# Altium schematic sheet HardwareArchitecture.SchDoc: Iris
size A3; Organization: Toradex AG; Address1: Altsagenstrasse 5; Address2: Horw; Address3: 6048; Address4: Switzerland; DocumentNumber: 2; Revision: V2.0; SheetNumber: 2; SheetTotal: 16; PageSetup: Record=PageOptions|CenterHorizontal=True|CenterVertical=True|PrintScale=0.73|XCorrection=1.00|YCorrection=1.00|PrintKind=0|BorderSize=5000000|LeftOffset=0|BottomOffset=0|Orientation=2|PaperLength=1000|PaperWidth=1000|Scale=100|PaperSource=7|PrintQuality=600|MediaType=1|DitherType=10|PaperKind=A4|PrintScaleMode=1
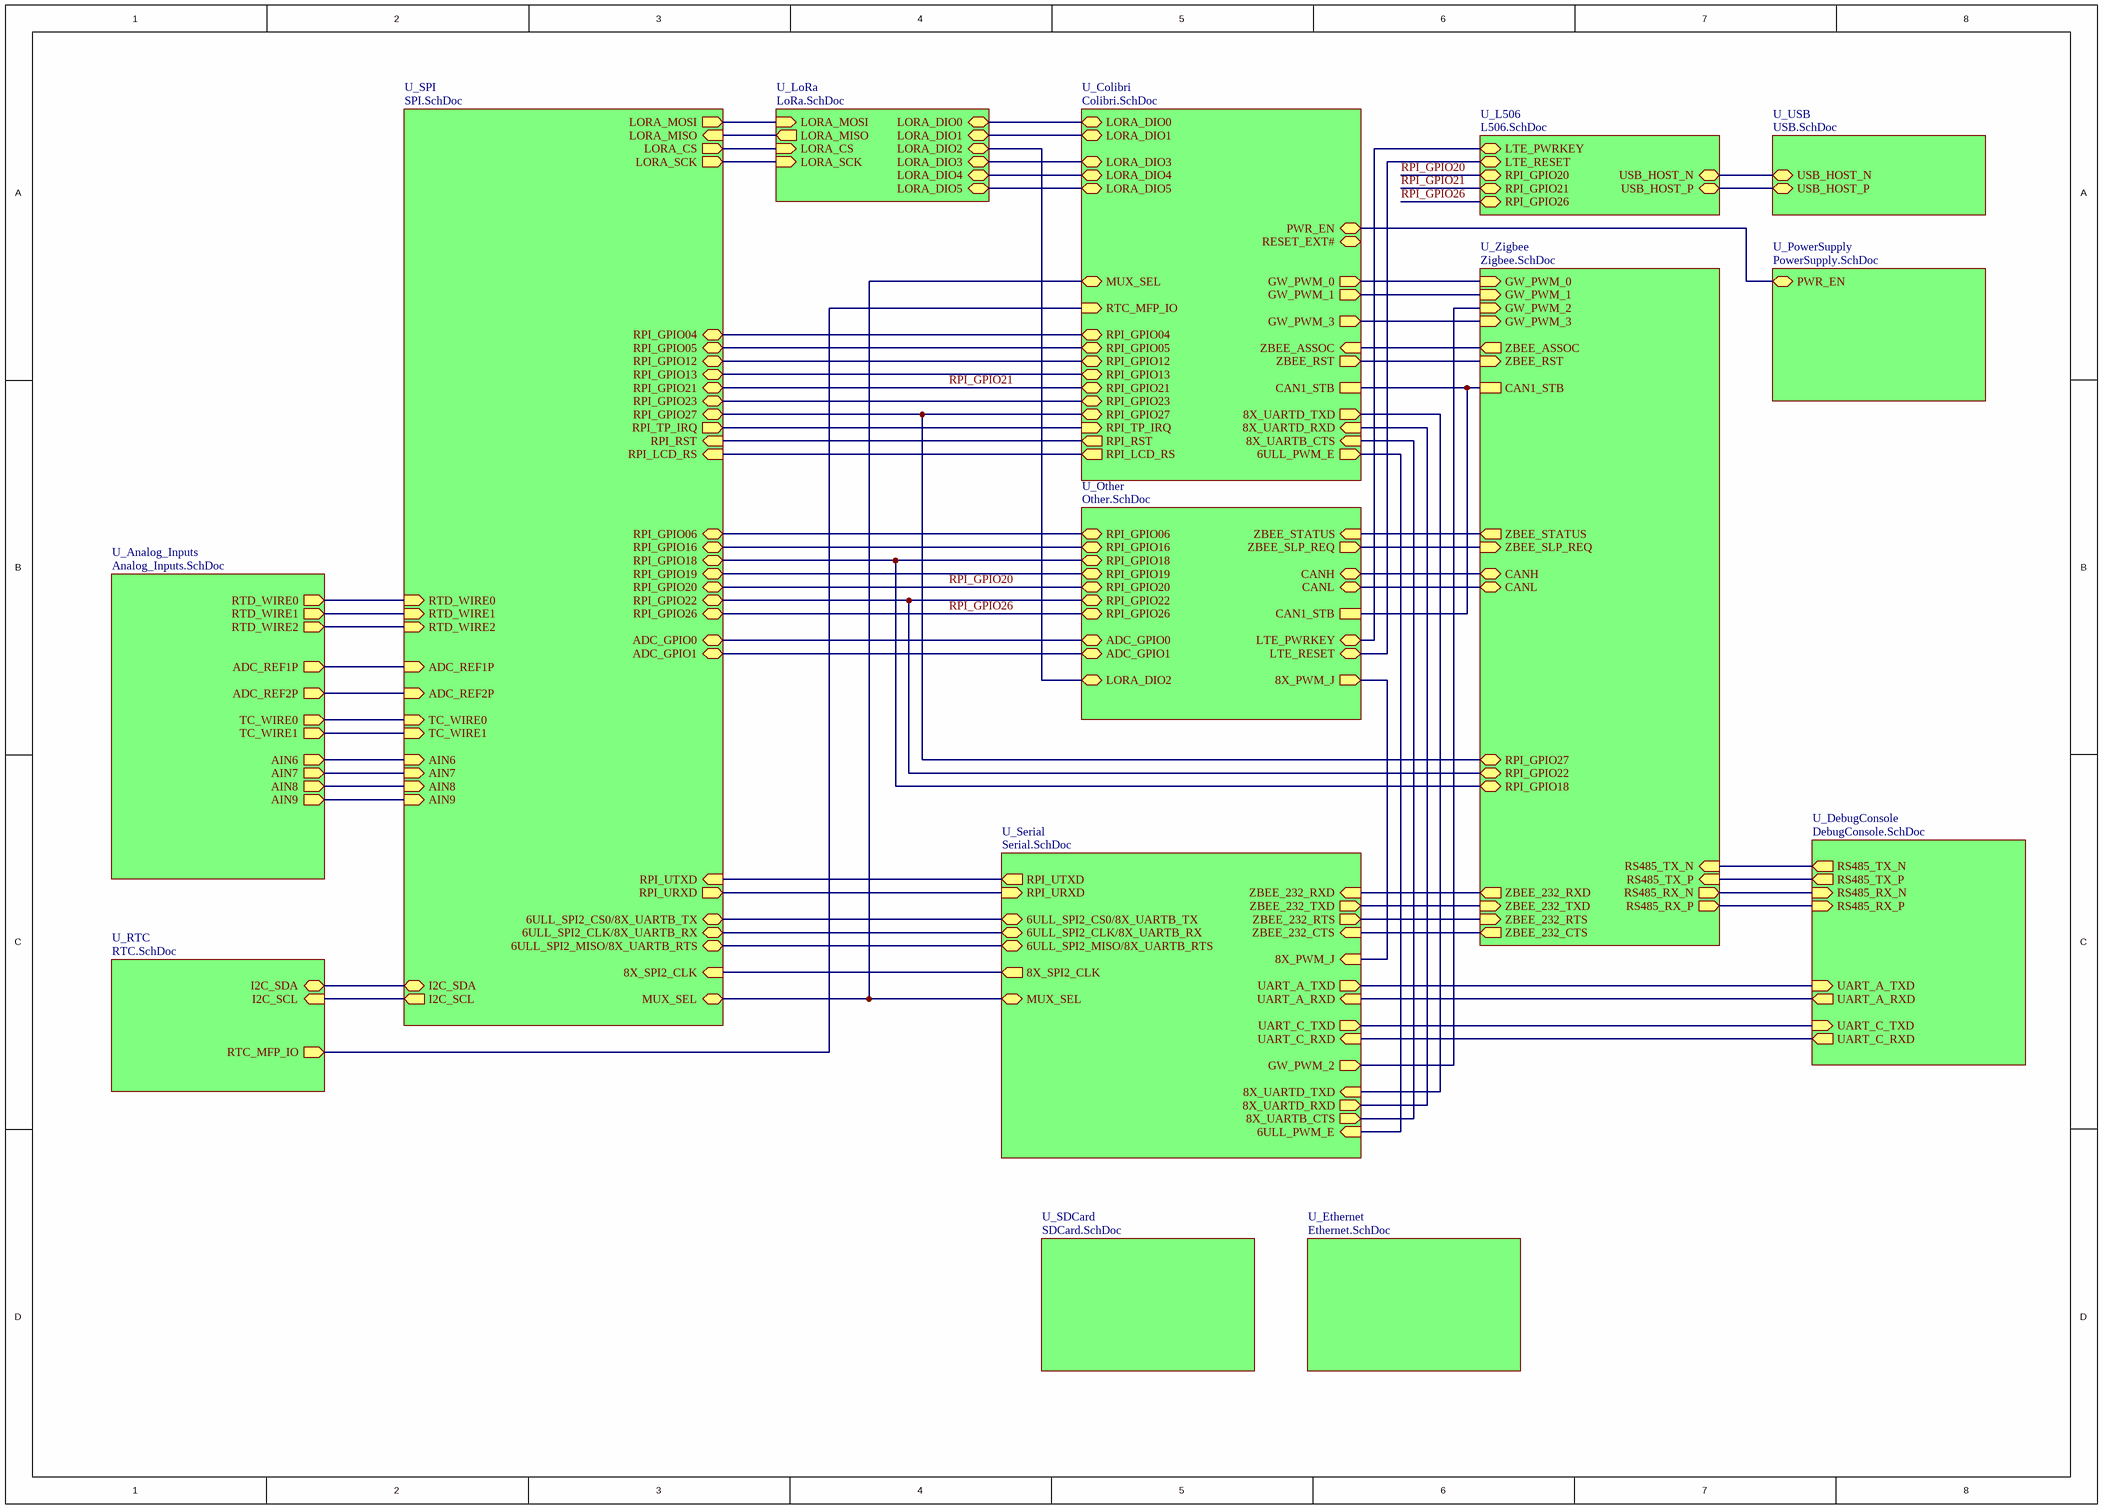
[diagram p0: HardwareArchitecture.SchDoc]

## Sub-sheets
U_Analog_Inputs = Analog_Inputs.SchDoc: ADC_REF1P (out), RTD_WIRE0 (out), RTD_WIRE1 (out), RTD_WIRE2 (out), TC_WIRE0 (out), TC_WIRE1 (out), ADC_REF2P (out), AIN8 (out), AIN9 (out), AIN7 (out), AIN6 (out)
U_Colibri = Colibri.SchDoc: RESET_EXT# (bidir), RTC_MFP_IO (in), 8X_UARTD_RXD (in), 8X_UARTD_TXD (out), 8X_UARTB_CTS (in), 6ULL_PWM_E (out), GW_PWM_3 (out), GW_PWM_0 (out), GW_PWM_1 (out), MUX_SEL (bidir), ZBEE_RST (out), RPI_LCD_RS (out), RPI_RST (out), RPI_TP_IRQ (in), LORA_DIO0 (bidir), LORA_DIO1 (bidir), LORA_DIO3 (bidir), LORA_DIO4 (bidir), LORA_DIO5 (bidir), ZBEE_ASSOC (in), RPI_GPIO04 (bidir), RPI_GPIO27 (bidir), RPI_GPIO05 (bidir), RPI_GPIO13 (bidir), RPI_GPIO21 (bidir), RPI_GPIO12 (bidir), RPI_GPIO23 (bidir), PWR_EN (bidir), CAN1_STB
U_DebugConsole = DebugConsole.SchDoc: UART_C_TXD (in), UART_C_RXD (out), UART_A_TXD (in), UART_A_RXD (out), RS485_RX_N (in), RS485_RX_P (in), RS485_TX_N (out), RS485_TX_P (out)
U_Ethernet = Ethernet.SchDoc: no entries
U_L506 = L506.SchDoc: LTE_PWRKEY (bidir), LTE_RESET (bidir), USB_HOST_N (bidir), USB_HOST_P (bidir), RPI_GPIO20 (bidir), RPI_GPIO21 (bidir), RPI_GPIO26 (bidir)
U_LoRa = LoRa.SchDoc: LORA_MISO (out), LORA_MOSI (in), LORA_CS (in), LORA_SCK (in), LORA_DIO0 (bidir), LORA_DIO1 (bidir), LORA_DIO2 (bidir), LORA_DIO4 (bidir), LORA_DIO3 (bidir), LORA_DIO5 (bidir)
U_Other = Other.SchDoc: 8X_PWM_J (out), LORA_DIO2 (bidir), ZBEE_SLP_REQ (out), ZBEE_STATUS (in), RPI_GPIO22 (bidir), RPI_GPIO06 (bidir), RPI_GPIO19 (bidir), RPI_GPIO26 (bidir), RPI_GPIO20 (bidir), RPI_GPIO16 (bidir), RPI_GPIO18 (bidir), ADC_GPIO0 (bidir), ADC_GPIO1 (bidir), CANH (bidir), CANL (bidir), LTE_PWRKEY (bidir), LTE_RESET (bidir), CAN1_STB
U_PowerSupply = PowerSupply.SchDoc: PWR_EN (bidir)
U_RTC = RTC.SchDoc: RTC_MFP_IO (out), I2C_SDA (bidir), I2C_SCL (in)
U_SDCard = SDCard.SchDoc: no entries
U_Serial = Serial.SchDoc: 8X_UARTD_RXD (out), 8X_UARTD_TXD (in), 8X_SPI2_CLK (out), 8X_UARTB_CTS (out), MUX_SEL (bidir), ZBEE_232_TXD (out), ZBEE_232_RXD (in), ZBEE_232_RTS (out), ZBEE_232_CTS (in), RPI_UTXD (out), RPI_URXD (in), 8X_PWM_J (in), 6ULL_PWM_E (in), GW_PWM_2 (out), 6ULL_SPI2_CLK/8X_UARTB_RX (bidir), 6ULL_SPI2_CS0/8X_UARTB_TX (bidir), UART_A_TXD (out), UART_A_RXD (in), UART_C_RXD (in), UART_C_TXD (out), 6ULL_SPI2_MISO/8X_UARTB_RTS (bidir)
U_SPI = SPI.SchDoc: RPI_TP_IRQ (out), RPI_LCD_RS (in), RPI_RST (in), MUX_SEL (bidir), 8X_SPI2_CLK (in), LORA_MISO (in), LORA_MOSI (out), LORA_CS (out), LORA_SCK (out), RPI_UTXD (in), RPI_URXD (out), I2C_SCL (out), I2C_SDA (bidir), RPI_GPIO04 (bidir), RPI_GPIO27 (bidir), RPI_GPIO05 (bidir), RPI_GPIO13 (bidir), RPI_GPIO21 (bidir), RPI_GPIO12 (bidir), RPI_GPIO23 (bidir), ADC_GPIO0 (bidir), ADC_GPIO1 (bidir), 6ULL_SPI2_CLK/8X_UARTB_RX (bidir), 6ULL_SPI2_CS0/8X_UARTB_TX (bidir), 6ULL_SPI2_MISO/8X_UARTB_RTS (bidir), RTD_WIRE0 (in), RTD_WIRE1 (in), TC_WIRE0 (in), TC_WIRE1 (in), AIN6 (in), AIN7 (in), AIN8 (in), AIN9 (in), ADC_REF1P (in), ADC_REF2P (in), RTD_WIRE2 (in), RPI_GPIO06 (bidir), RPI_GPIO16 (bidir), RPI_GPIO18 (bidir), RPI_GPIO19 (bidir), RPI_GPIO20 (bidir), RPI_GPIO22 (bidir), RPI_GPIO26 (bidir)
U_USB = USB.SchDoc: USB_HOST_N (bidir), USB_HOST_P (bidir)
U_Zigbee = Zigbee.SchDoc: ZBEE_RST (in), ZBEE_SLP_REQ (in), ZBEE_STATUS (out), ZBEE_ASSOC (out), CANH (bidir), GW_PWM_1 (in), GW_PWM_0 (in), GW_PWM_2 (in), GW_PWM_3 (in), RS485_TX_N (in), RS485_TX_P (in), RS485_RX_N (out), RS485_RX_P (out), CANL (bidir), ZBEE_232_RXD (out), ZBEE_232_TXD (in), ZBEE_232_RTS (in), ZBEE_232_CTS (out), RPI_GPIO27 (bidir), RPI_GPIO22 (bidir), RPI_GPIO18 (bidir), CAN1_STB

## Nets
RPI_GPIO20: sheet U_L506/RPI_GPIO20, sheet U_Other/RPI_GPIO20, sheet U_SPI/RPI_GPIO20
RPI_GPIO21: sheet U_Colibri/RPI_GPIO21, sheet U_L506/RPI_GPIO21, sheet U_SPI/RPI_GPIO21
RPI_GPIO26: sheet U_L506/RPI_GPIO26, sheet U_Other/RPI_GPIO26, sheet U_SPI/RPI_GPIO26
(unnamed): sheet U_Analog_Inputs/ADC_REF1P, sheet U_SPI/ADC_REF1P
(unnamed): sheet U_Analog_Inputs/RTD_WIRE0, sheet U_SPI/RTD_WIRE0
(unnamed): sheet U_Analog_Inputs/RTD_WIRE1, sheet U_SPI/RTD_WIRE1
(unnamed): sheet U_Analog_Inputs/RTD_WIRE2, sheet U_SPI/RTD_WIRE2
(unnamed): sheet U_Analog_Inputs/TC_WIRE0, sheet U_SPI/TC_WIRE0
(unnamed): sheet U_Analog_Inputs/TC_WIRE1, sheet U_SPI/TC_WIRE1
(unnamed): sheet U_Analog_Inputs/ADC_REF2P, sheet U_SPI/ADC_REF2P
(unnamed): sheet U_Analog_Inputs/AIN8, sheet U_SPI/AIN8
(unnamed): sheet U_Analog_Inputs/AIN9, sheet U_SPI/AIN9
(unnamed): sheet U_Analog_Inputs/AIN7, sheet U_SPI/AIN7
(unnamed): sheet U_Analog_Inputs/AIN6, sheet U_SPI/AIN6
(unnamed): sheet U_Colibri/RTC_MFP_IO, sheet U_RTC/RTC_MFP_IO
(unnamed): sheet U_Colibri/8X_UARTD_RXD, sheet U_Serial/8X_UARTD_RXD
(unnamed): sheet U_Colibri/8X_UARTD_TXD, sheet U_Serial/8X_UARTD_TXD
(unnamed): sheet U_Colibri/8X_UARTB_CTS, sheet U_Serial/8X_UARTB_CTS
(unnamed): sheet U_Colibri/6ULL_PWM_E, sheet U_Serial/6ULL_PWM_E
(unnamed): sheet U_Colibri/GW_PWM_3, sheet U_Zigbee/GW_PWM_3
(unnamed): sheet U_Colibri/GW_PWM_0, sheet U_Zigbee/GW_PWM_0
(unnamed): sheet U_Colibri/GW_PWM_1, sheet U_Zigbee/GW_PWM_1
(unnamed): sheet U_Colibri/MUX_SEL, sheet U_Serial/MUX_SEL, sheet U_SPI/MUX_SEL
(unnamed): sheet U_Colibri/ZBEE_RST, sheet U_Zigbee/ZBEE_RST
(unnamed): sheet U_Colibri/RPI_LCD_RS, sheet U_SPI/RPI_LCD_RS
(unnamed): sheet U_Colibri/RPI_RST, sheet U_SPI/RPI_RST
(unnamed): sheet U_Colibri/RPI_TP_IRQ, sheet U_SPI/RPI_TP_IRQ
(unnamed): sheet U_Colibri/LORA_DIO0, sheet U_LoRa/LORA_DIO0
(unnamed): sheet U_Colibri/LORA_DIO1, sheet U_LoRa/LORA_DIO1
(unnamed): sheet U_Colibri/LORA_DIO3, sheet U_LoRa/LORA_DIO3
(unnamed): sheet U_Colibri/LORA_DIO4, sheet U_LoRa/LORA_DIO4
(unnamed): sheet U_Colibri/LORA_DIO5, sheet U_LoRa/LORA_DIO5
(unnamed): sheet U_Colibri/ZBEE_ASSOC, sheet U_Zigbee/ZBEE_ASSOC
(unnamed): sheet U_Colibri/RPI_GPIO04, sheet U_SPI/RPI_GPIO04
(unnamed): sheet U_Colibri/RPI_GPIO27, sheet U_SPI/RPI_GPIO27, sheet U_Zigbee/RPI_GPIO27
(unnamed): sheet U_Colibri/RPI_GPIO05, sheet U_SPI/RPI_GPIO05
(unnamed): sheet U_Colibri/RPI_GPIO13, sheet U_SPI/RPI_GPIO13
(unnamed): sheet U_Colibri/RPI_GPIO12, sheet U_SPI/RPI_GPIO12
(unnamed): sheet U_Colibri/RPI_GPIO23, sheet U_SPI/RPI_GPIO23
(unnamed): sheet U_Colibri/PWR_EN, sheet U_PowerSupply/PWR_EN
(unnamed): sheet U_Colibri/CAN1_STB, sheet U_Other/CAN1_STB, sheet U_Zigbee/CAN1_STB
(unnamed): sheet U_L506/LTE_PWRKEY, sheet U_Other/LTE_PWRKEY
(unnamed): sheet U_L506/LTE_RESET, sheet U_Other/LTE_RESET
(unnamed): sheet U_L506/USB_HOST_N, sheet U_USB/USB_HOST_N
(unnamed): sheet U_L506/USB_HOST_P, sheet U_USB/USB_HOST_P
(unnamed): sheet U_LoRa/LORA_MISO, sheet U_SPI/LORA_MISO
(unnamed): sheet U_LoRa/LORA_MOSI, sheet U_SPI/LORA_MOSI
(unnamed): sheet U_LoRa/LORA_CS, sheet U_SPI/LORA_CS
(unnamed): sheet U_LoRa/LORA_SCK, sheet U_SPI/LORA_SCK
(unnamed): sheet U_LoRa/LORA_DIO2, sheet U_Other/LORA_DIO2
(unnamed): sheet U_Other/8X_PWM_J, sheet U_Serial/8X_PWM_J
(unnamed): sheet U_Other/ZBEE_SLP_REQ, sheet U_Zigbee/ZBEE_SLP_REQ
(unnamed): sheet U_Other/ZBEE_STATUS, sheet U_Zigbee/ZBEE_STATUS
(unnamed): sheet U_Other/RPI_GPIO22, sheet U_SPI/RPI_GPIO22, sheet U_Zigbee/RPI_GPIO22
(unnamed): sheet U_Other/RPI_GPIO06, sheet U_SPI/RPI_GPIO06
(unnamed): sheet U_Other/RPI_GPIO19, sheet U_SPI/RPI_GPIO19
(unnamed): sheet U_Other/RPI_GPIO16, sheet U_SPI/RPI_GPIO16
(unnamed): sheet U_Other/RPI_GPIO18, sheet U_SPI/RPI_GPIO18, sheet U_Zigbee/RPI_GPIO18
(unnamed): sheet U_Other/ADC_GPIO0, sheet U_SPI/ADC_GPIO0
(unnamed): sheet U_Other/ADC_GPIO1, sheet U_SPI/ADC_GPIO1
(unnamed): sheet U_Other/CANH, sheet U_Zigbee/CANH
(unnamed): sheet U_Other/CANL, sheet U_Zigbee/CANL
(unnamed): sheet U_Serial/8X_SPI2_CLK, sheet U_SPI/8X_SPI2_CLK
(unnamed): sheet U_Serial/ZBEE_232_TXD, sheet U_Zigbee/ZBEE_232_TXD
(unnamed): sheet U_Serial/ZBEE_232_RXD, sheet U_Zigbee/ZBEE_232_RXD
(unnamed): sheet U_Serial/ZBEE_232_RTS, sheet U_Zigbee/ZBEE_232_RTS
(unnamed): sheet U_Serial/ZBEE_232_CTS, sheet U_Zigbee/ZBEE_232_CTS
(unnamed): sheet U_Serial/RPI_UTXD, sheet U_SPI/RPI_UTXD
(unnamed): sheet U_Serial/RPI_URXD, sheet U_SPI/RPI_URXD
(unnamed): sheet U_Serial/GW_PWM_2, sheet U_Zigbee/GW_PWM_2
(unnamed): sheet U_Serial/6ULL_SPI2_CLK/8X_UARTB_RX, sheet U_SPI/6ULL_SPI2_CLK/8X_UARTB_RX
(unnamed): sheet U_Serial/6ULL_SPI2_CS0/8X_UARTB_TX, sheet U_SPI/6ULL_SPI2_CS0/8X_UARTB_TX
(unnamed): sheet U_Serial/UART_A_TXD, sheet U_DebugConsole/UART_A_TXD
(unnamed): sheet U_Serial/UART_A_RXD, sheet U_DebugConsole/UART_A_RXD
(unnamed): sheet U_Serial/UART_C_RXD, sheet U_DebugConsole/UART_C_RXD
(unnamed): sheet U_Serial/UART_C_TXD, sheet U_DebugConsole/UART_C_TXD
(unnamed): sheet U_Serial/6ULL_SPI2_MISO/8X_UARTB_RTS, sheet U_SPI/6ULL_SPI2_MISO/8X_UARTB_RTS
(unnamed): sheet U_SPI/I2C_SCL, sheet U_RTC/I2C_SCL
(unnamed): sheet U_SPI/I2C_SDA, sheet U_RTC/I2C_SDA
(unnamed): sheet U_Zigbee/RS485_TX_N, sheet U_DebugConsole/RS485_TX_N
(unnamed): sheet U_Zigbee/RS485_TX_P, sheet U_DebugConsole/RS485_TX_P
(unnamed): sheet U_Zigbee/RS485_RX_N, sheet U_DebugConsole/RS485_RX_N
(unnamed): sheet U_Zigbee/RS485_RX_P, sheet U_DebugConsole/RS485_RX_P

## Notes on the sheet
- Title
- Size:
- Date:
- A3
- Number:
- Time:
- Revision:
- Sheet
- of
- File: